# Altium schematic sheet [02] BLOCK DIAGRAM.SchDoc: Template
size A4; Author: Hom; CompanyName: KitSprout; DrawnBy: Hom; Engineer: Hom; Organization: KitSprout; Revision: A; SheetNumber: 2; SheetTotal: 7; Version: 0.0; LibVersion: 0.0
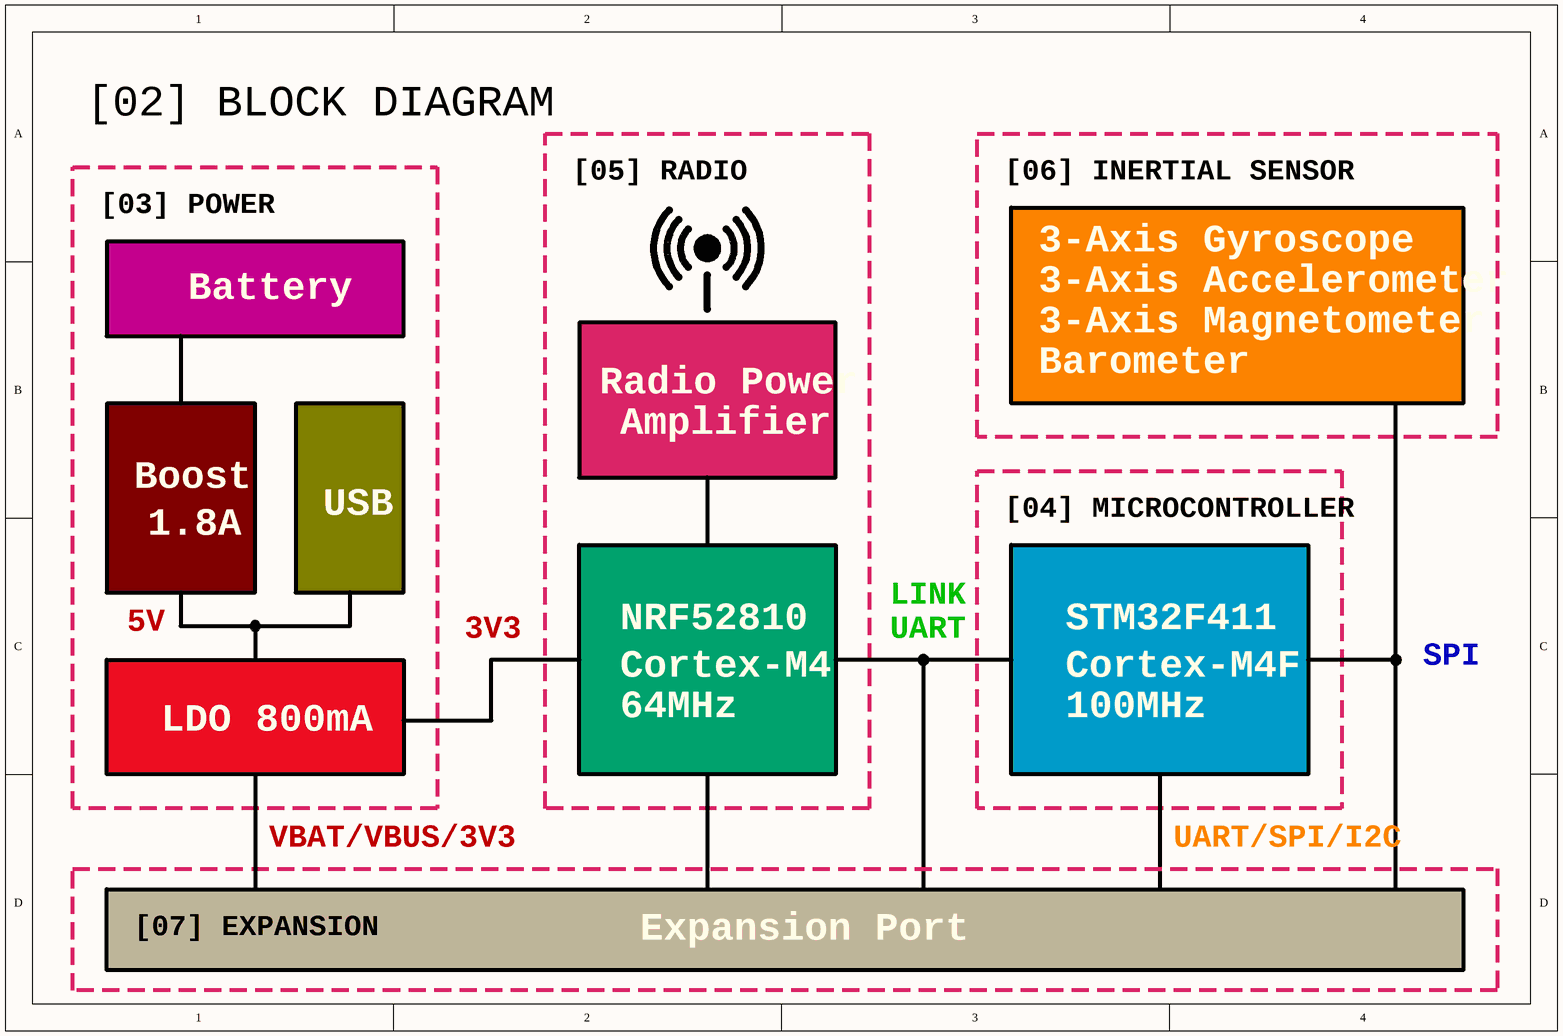
[diagram p0: [02] BLOCK DIAGRAM.SchDoc]

## Sub-sheets
EXPANSION = [07] EXPANSION.SchDoc: no entries
LDO = [03] POWER.SchDoc: no entries
NRF52 = [05] RADIO.SchDoc: no entries
SENSOR = [06] INERTIAL SENSOR.SchDoc: no entries
STM32 = [04] MICROCONTROLLER.SchDoc: no entries

## Notes on the sheet
- [02] BLOCK DIAGRAM
- [03] POWER
- [05] RADIO
- [06] INERTIAL SENSOR
- Battery
- 3-Axis Gyroscope
- 3-Axis Accelerometer
- Barometer
- 3-Axis Magnetometer
- Radio Power
- Amplifier
- Boost
- USB
- [04] MICROCONTROLLER
- 1.8A
- 5V
- 3V3
- NRF52810
- UART
- LINK
- STM32F411
- Cortex-M4
- Cortex-M4F
- SPI
- LDO
- 800mA
- 64MHz
- 100MHz
- VBAT/VBUS/3V3
- UART/SPI/I2C
- [07] EXPANSION
- Expansion Port